# EAGLE design TEFNUT_proto_v1 (EAGLE 9.7.0)

## Sheet 1 of 4: CONNECTORS
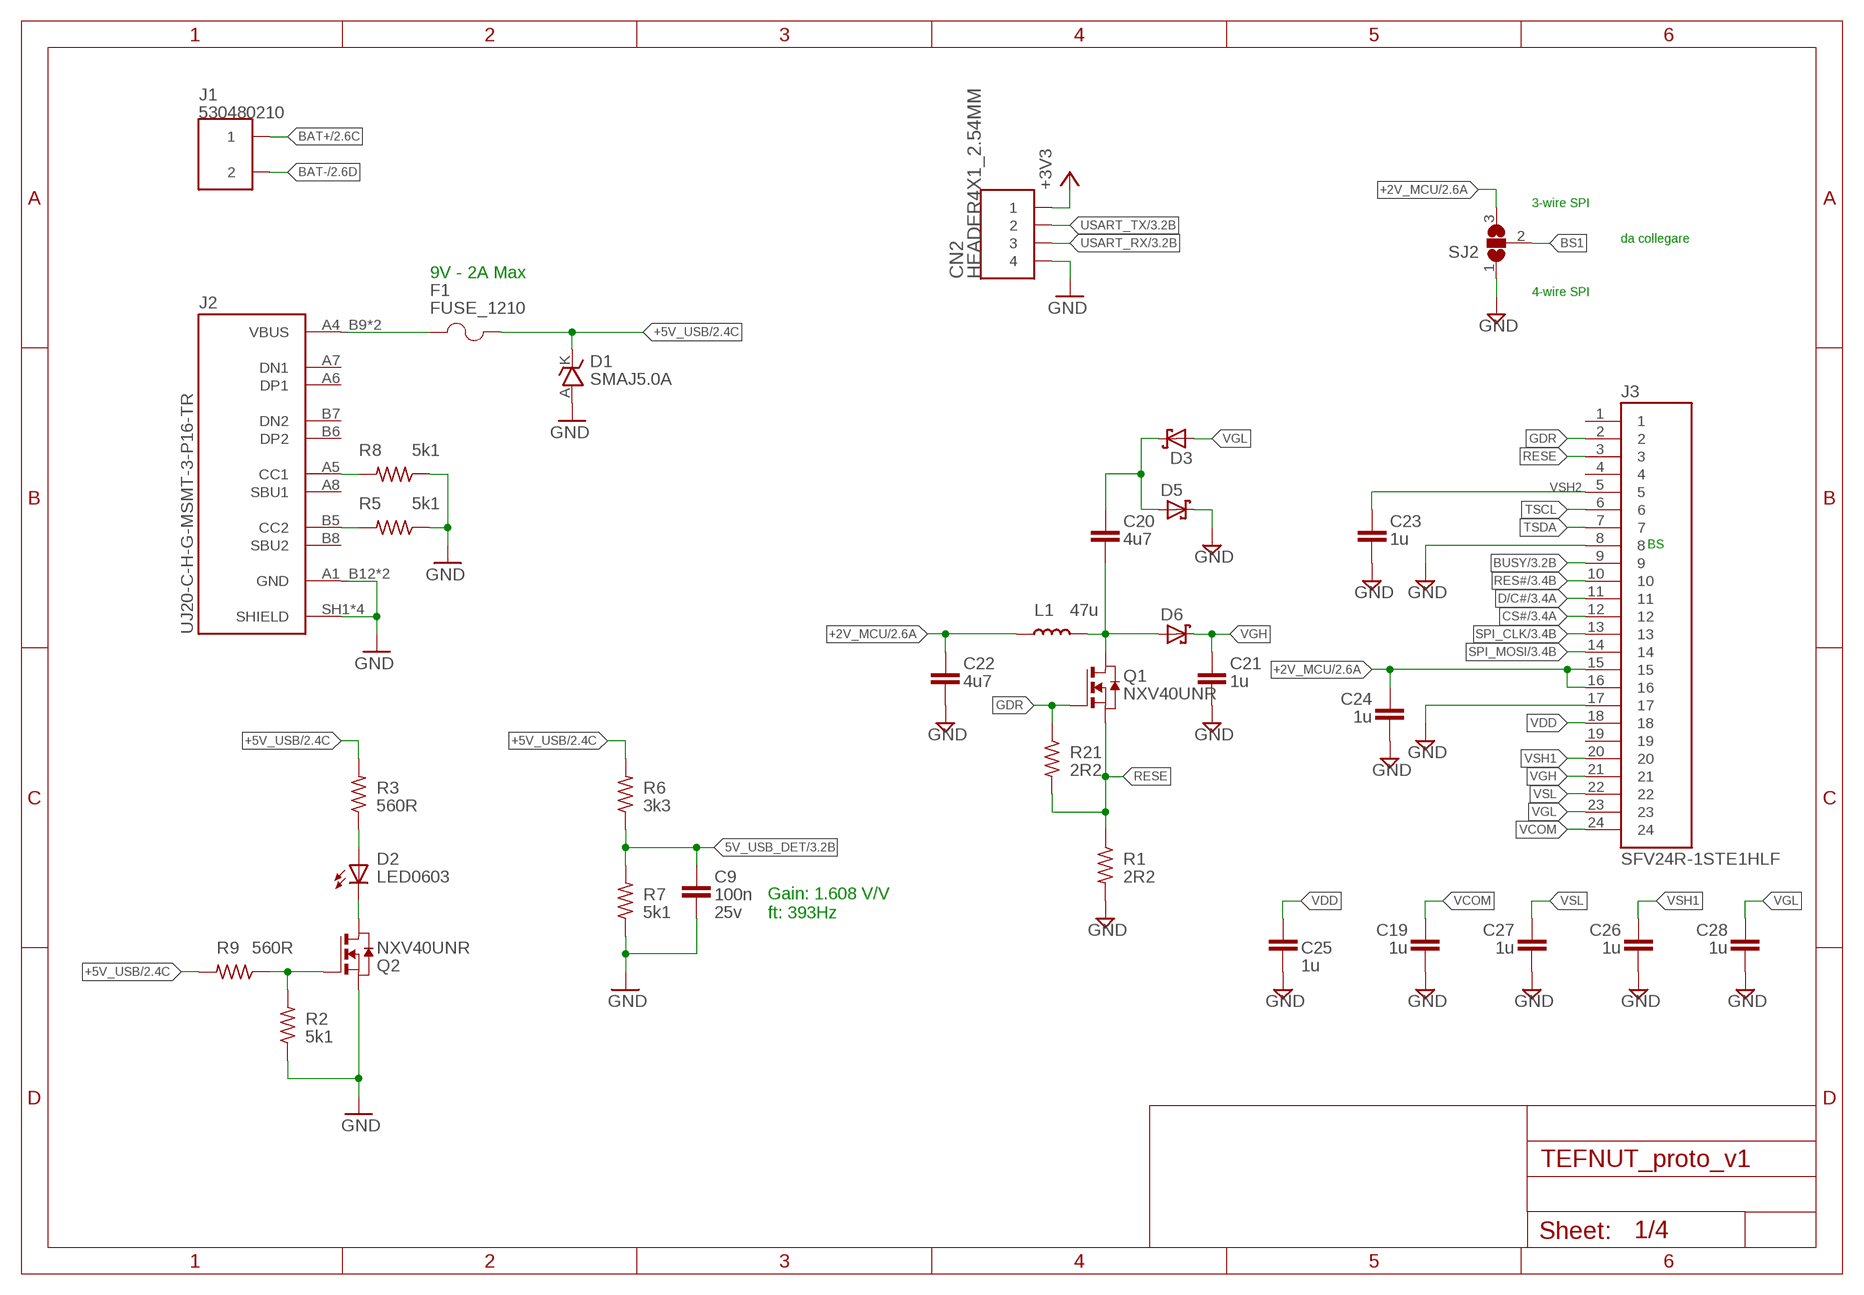
[diagram p0: schematic, sheet 1]

### Parts
C9  100n  C0603  [C0603[1608]]
C19  1u  C0603  [C0603[1608]]
C20  4u7  C0603  [C0603[1608]]
C21  1u  C0603  [C0603[1608]]
C22  4u7  C0603  [C0603[1608]]
C23  1u  C0603  [C0603[1608]]
C24  1u  C0603  [C0603[1608]]
C25  1u  C0603  [C0603[1608]]
C26  1u  C0603  [C0603[1608]]
C27  1u  C0603  [C0603[1608]]
C28  1u  C0603  [C0603[1608]]
CN2  HEADER4X1_2.54MM  [HEADER4X1_2.54MM]
D1  TVS214AC  [DO-214AC]
D2  LED0603  [LED0603]
D3  SCHOTTKY_DIODE_SOD123  [SOD123]
D5  SCHOTTKY_DIODE_SOD123  [SOD123]
D6  SCHOTTKY_DIODE_SOD123  [SOD123]
F1  FUSE_1210  [R1210[3225]]
J1  530480210  [530480210]
J2  UJ20-C-H-G-MSMT-3-P16-TR  [SAMESKY_UJ20-C-H-G-MSMT-3-P16-TR]
J3  SFV24R-1STE1HLF  [AMPHENOL_SFV24R-1STE1HLF]
L1  47u  L0805  [L0805[2012]]
Q1  NXV40UNR  MOSFET_N_SOT23-3  [SOT23-3]
Q2  NXV40UNR  MOSFET_N_SOT23-3  [SOT23-3]
R1  2R2  R_0603  [R0603]
R2  5k1  R_0603  [R0603]
R3  560R  R_0603  [R0603]
R5  5k1  R_0603  [R0603]
R6  3k3  R_0603  [R0603]
R7  5k1  R_0603  [R0603]
R8  5k1  R_0603  [R0603]
R9  560R  R_0603  [R0603]
R21  2R2  R_0603  [R0603]
SJ2  SJ2W  [SJ_2]

### Nets
5V_USB_DET: C9.1 R6.1 R7.2 ; also sheet 3
+2V_MCU: C22.1 C24.1 J3.15 J3.16 L1.1 SJ2.3 ; also sheet 2,3,4
+3V3 [Supply]: CN2.1
+5V_USB: D1.K F1.2 R3.2 R6.2 R9.2 ; also sheet 2
BAT+ [Supply]: J1.1 ; also sheet 2
BAT-: J1.2 ; also sheet 2
BS1: SJ2.2
BUSY: J3.9 ; also sheet 3
CS#: J3.12 ; also sheet 3
D/C#: J3.11 ; also sheet 3
GDR: J3.2 Q1.1(G) R21.1
GND [Supply]: C9.2 C19.2 C21.2 C22.2 C23.2 C24.2 C25.2 C26.2 C27.2 C28.2 CN2.4 D1.A D5.K J2.A1_B12(GND) J2.B1_A12(GND) J2.SH1(SHIELD) J2.SH2(SHIELD) J2.SH3(SHIELD) J2.SH4(SHIELD) J3.8 J3.17 Q2.2(S) R1.2 R2.1 R5.1 R7.1 R8.1 SJ2.1 ; also sheet 2,3,4
N$2: D2.2(K) Q2.3(D)
N$3: D2.1(A) R3.1
N$4: J2.A5(CC1) R8.2
N$5: J2.B5(CC2) R5.2
N$6: F1.1 J2.A4_B9(VBUS) J2.B4_A9(VBUS)
N$14: C20.1 D3.K D5.A
N$16: C20.2 D6.A L1.2 Q1.3(D)
N$81: Q2.1(G) R2.2 R9.1
RES#: J3.10 ; also sheet 3
RESE: J3.3 Q1.2(S) R1.1 R21.2
SPI_CLK: J3.13 ; also sheet 3
SPI_MOSI: J3.14 ; also sheet 3
TSCL: J3.6
TSDA: J3.7
USART_RX: CN2.3 ; also sheet 3
USART_TX: CN2.2 ; also sheet 3
VCOM: C19.1 J3.24
VDD: C25.1 J3.18
VGH: C21.1 D6.K J3.21
VGL: C28.1 D3.A J3.23
VSH1: C26.1 J3.20
VSH2: C23.1 J3.5
VSL: C27.1 J3.22
Unconnected: J2.A6(DP1) J2.A7(DN1) J2.A8(SBU1) J2.B6(DP2) J2.B7(DN2) J2.B8(SBU2) J3.1 J3.4 J3.19

### Notes on the sheet
- 3-wire SPI
- da collegare
- 9V - 2A Max
- 4-wire SPI
- BS
- Gain: 1.608 V/V
  ft: 393Hz

## Sheet 2 of 4: SUPPLY
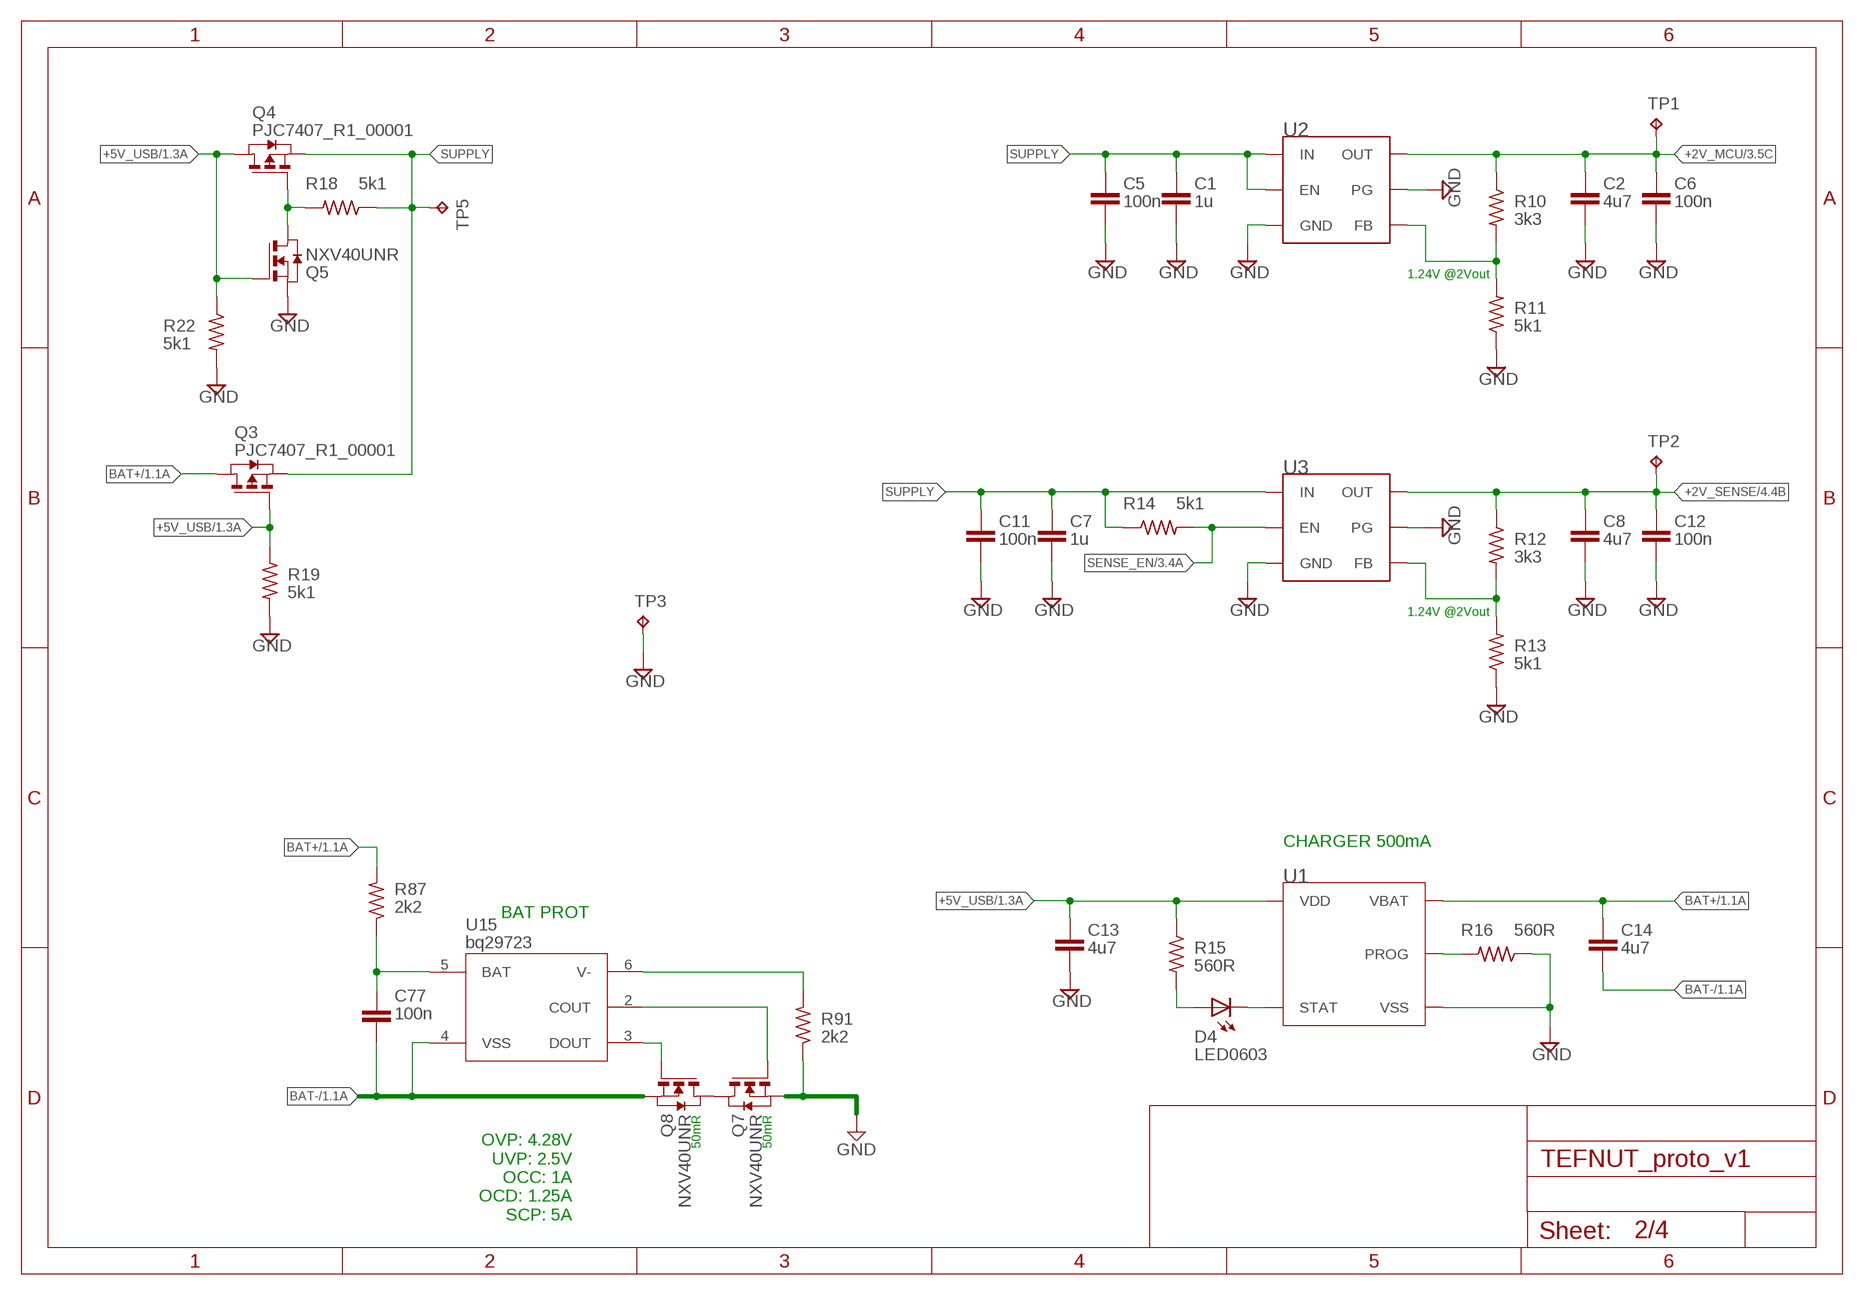
[diagram p1: schematic, sheet 2]

### Parts
C1  1u  C0603  [C0603[1608]]
C2  4u7  C0603  [C0603[1608]]
C5  100n  C0603  [C0603[1608]]
C6  100n  C0603  [C0603[1608]]
C7  1u  C0603  [C0603[1608]]
C8  4u7  C0603  [C0603[1608]]
C11  100n  C0603  [C0603[1608]]
C12  100n  C0603  [C0603[1608]]
C13  4u7  C0805  [C0805[2012]]
C14  4u7  C0805  [C0805[2012]]
C77  100n  C0603  [C0603[1608]]
D4  LED0603  [LED0603]
Q3  PJC7407_R1_00001  MOSFET_P_SOT323  [SOT323-3(SC-70-3)]
Q4  PJC7407_R1_00001  MOSFET_P_SOT323  [SOT323-3(SC-70-3)]
Q5  NXV40UNR  MOSFET_N_SOT23-3  [SOT23-3]
Q7  NXV40UNR  MOSFET_N_SOT23-3  [SOT23-3]
Q8  NXV40UNR  MOSFET_N_SOT23-3  [SOT23-3]
R10  3k3  R_0603  [R0603]
R11  5k1  R_0603  [R0603]
R12  3k3  R_0603  [R0603]
R13  5k1  R_0603  [R0603]
R14  5k1  R_0603  [R0603]
R15  560R  R_0603  [R0603]
R16  560R  R_0603  [R0603]
R18  5k1  R_0603  [R0603[1608]]
R19  5k1  R_0603  [R0603[1608]]
R22  5k1  R_0603  [R0603[1608]]
R87  2k2  R_0603  [R0603]
R91  2k2  R_0603  [R0603]
TP1  TPB1,27  [B1,27]
TP2  TPB1,27  [B1,27]
TP3  TPB1,27  [B1,27]
TP5  TPB1,27  [B1,27]
U1  MCP73831T  [SOT23-5]
U2  TPS7A2501DRVRDRV0006A-IPC_B  [6-WDFN]
U3  TPS7A2501DRVRDRV0006A-IPC_B  [6-WDFN]
U15  bq29723  BQ297XX  [WSON6]

### Nets
+2V_MCU: C2.1 C6.1 R10.1 TP1.TP U2.1(OUT) ; also sheet 1,3,4
+2V_SENSE: C8.1 C12.1 R12.1 TP2.TP U3.1(OUT) ; also sheet 4
+5V_USB: C13.1 Q3.1(G) Q4.3(D) Q5.1(G) R15.1 R19.1 R22.1 U1.4(VDD) ; also sheet 1
BAT+ [Supply]: C14.1 Q3.3(D) R87.2 U1.3(VBAT) ; also sheet 1
BAT-: C14.2 C77.2 Q8.2(S) U15.4(VSS) ; also sheet 1
GND [Supply]: C1.2 C2.2 C5.2 C6.2 C7.2 C8.2 C11.2 C12.2 C13.2 Q5.2(S) Q7.2(S) R11.1 R13.1 R16.1 R19.2 R22.2 R91.1 TP3.TP U1.2(VSS) U2.3(PG) U2.5(GND) U2.7(GND) U3.3(PG) U3.5(GND) U3.7(GND) ; also sheet 1,3,4
N$1: C77.1 R87.1 U15.5(BAT)
N$7: D4.1(A) R15.2
N$8: R10.2 R11.2 U2.2(FB)
N$9: R12.2 R13.2 U3.2(FB)
N$11: R16.2 U1.5(PROG)
N$12: D4.2(K) U1.1(STAT)
N$15: Q4.1(G) Q5.3(D) R18.2
N$18: R91.2 U15.6(V-)
N$19: Q7.3(D) Q8.3(D)
N$20: Q7.1(G) U15.2(COUT)
N$24: Q8.1(G) U15.3(DOUT)
SENSE_EN: R14.2 U3.4(EN) ; also sheet 3
SUPPLY: C1.1 C5.1 C7.1 C11.1 Q3.2(S) Q4.2(S) R14.1 R18.1 TP5.TP U2.4(EN) U2.6(IN) U3.6(IN)

### Notes on the sheet
- 1.24V @2Vout
- 1.24V @2Vout
- CHARGER 500mA
- BAT PROT
- 50mR | 50mR
- OVP: 4.28V
  UVP: 2.5V
  OCC: 1A
  OCD: 1.25A
  SCP: 5A

## Sheet 3 of 4: MCU
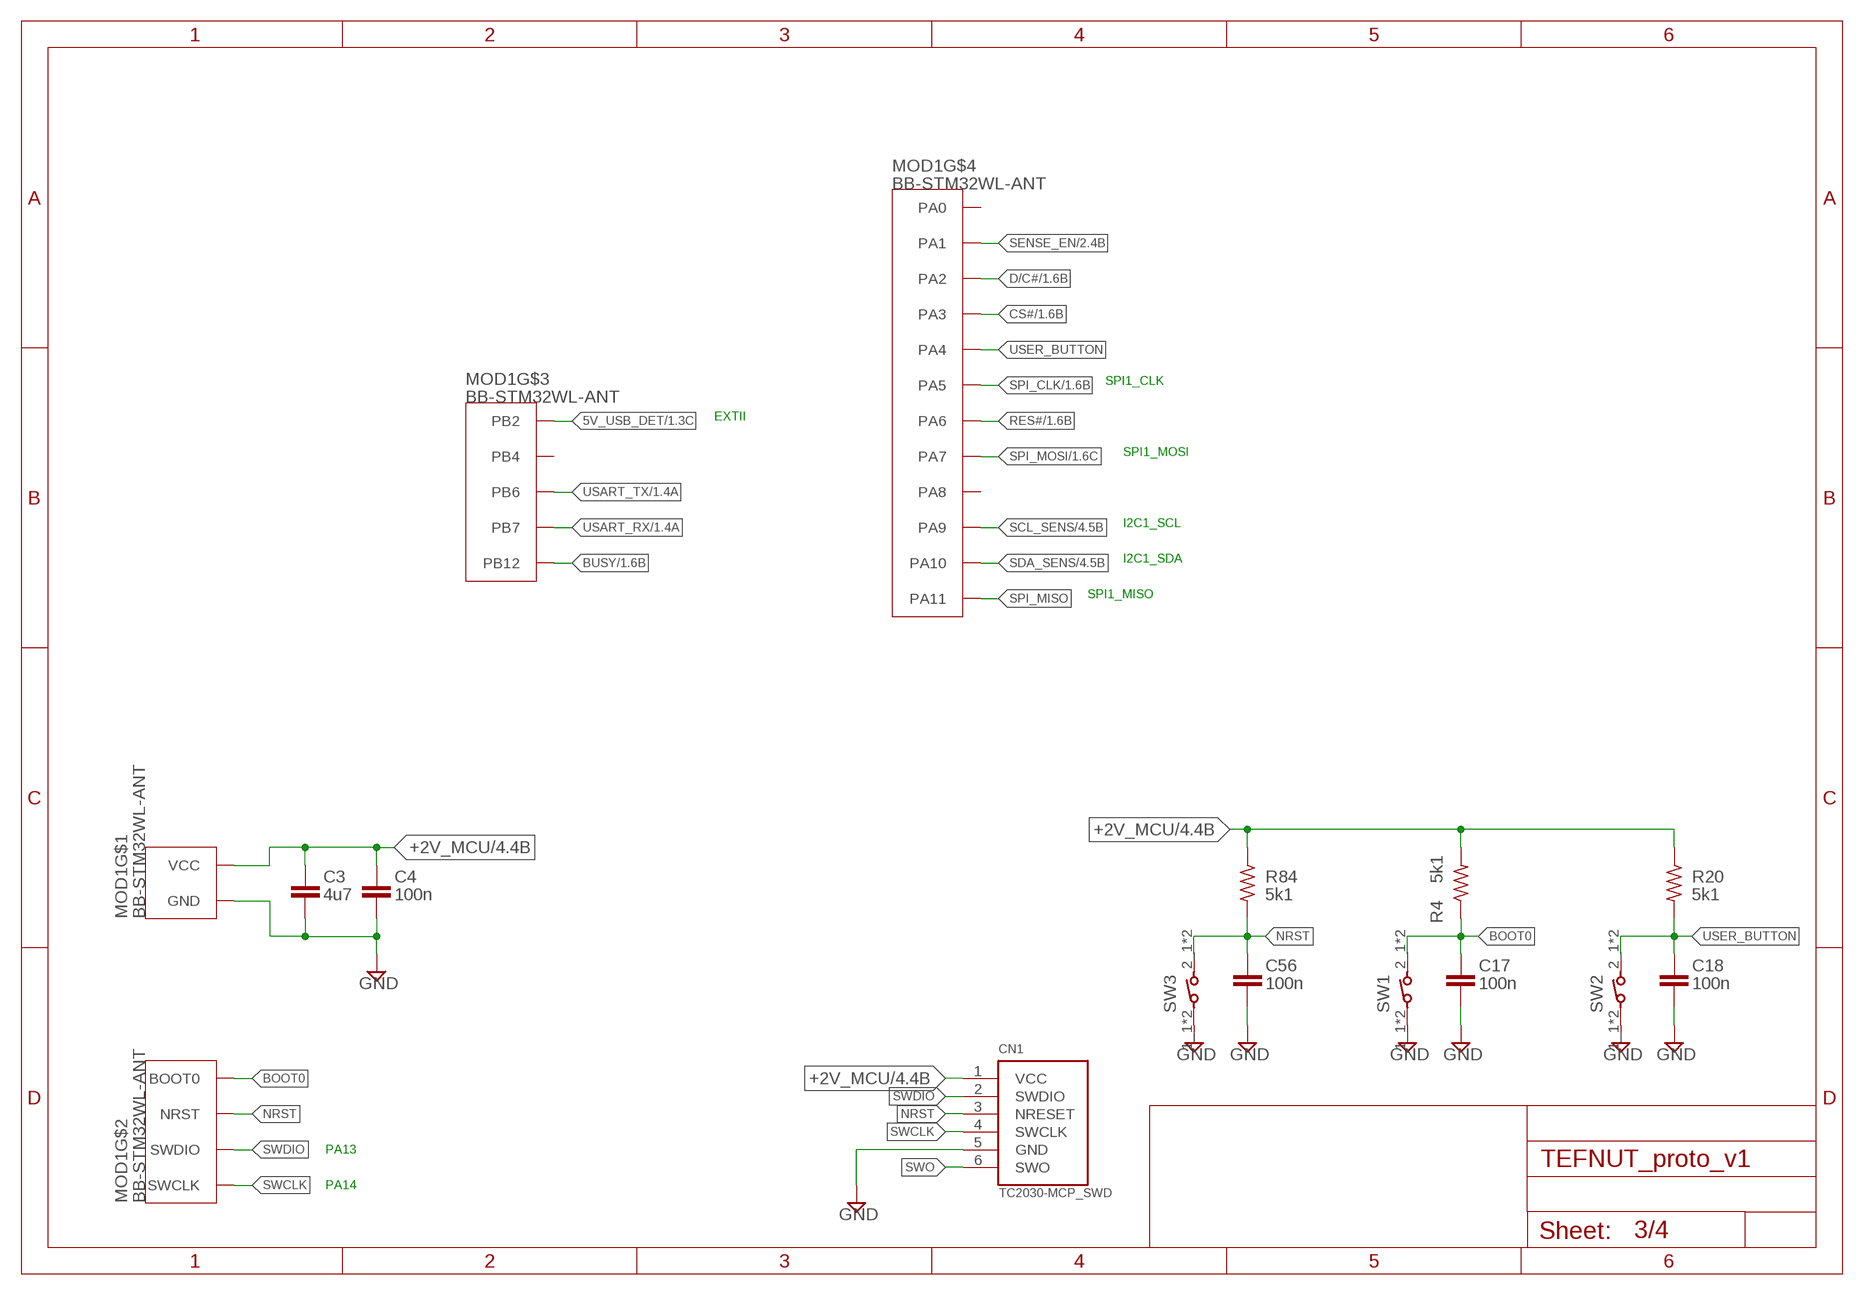
[diagram p2: schematic, sheet 3]

### Parts
C3  4u7  C0805  [C0805[2012]]
C4  100n  C0805  [C0805[2012]]
C17  100n  C0603  [C0603[1608]]
C18  100n  C0603  [C0603[1608]]
C56  100n  C0603  [C0603[1608]]
CN1  TC2030-MCP_SWD  [TC2030-IDC]
MOD1  BB-STM32WL-ANT  [BB-STM32WL-ANT]
R4  5k1  R_0603  [R0603]
R20  5k1  R_0603  [R0603]
R84  5k1  R_0603  [R0603]
SW1  SWITCHEVQ_4PIN  [EVQ-P7L01P]
SW2  SWITCHEVQ_4PIN  [EVQ-P7L01P]
SW3  SWITCHEVQ_4PIN  [EVQ-P7L01P]

### Nets
5V_USB_DET: MOD1.PB2 ; also sheet 1
+2V_MCU: C3.1 C4.1 CN1.1(VCC) MOD1.VCC R4.2 R20.1 R84.1 ; also sheet 1,2,4
BOOT0: C17.1 MOD1.BOOT0 R4.1 SW1.2_1 SW1.2_2
BUSY: MOD1.PB12 ; also sheet 1
CS#: MOD1.PA3 ; also sheet 1
D/C#: MOD1.PA2 ; also sheet 1
GND [Supply]: C3.2 C4.2 C17.2 C18.2 C56.2 CN1.5(GND) MOD1.GND MOD1.GND@2(GND) SW1.1_1 SW1.1_2 SW2.1_1 SW2.1_2 SW3.1_1 SW3.1_2 ; also sheet 1,2,4
NRST: C56.1 CN1.3(NRESET) MOD1.NRST R84.2 SW3.2_1 SW3.2_2
RES#: MOD1.PA6 ; also sheet 1
SCL_SENS: MOD1.PA9 ; also sheet 4
SDA_SENS: MOD1.PA10 ; also sheet 4
SENSE_EN: MOD1.PA1 ; also sheet 2
SPI_CLK: MOD1.PA5 ; also sheet 1
SPI_MISO: MOD1.PA11
SPI_MOSI: MOD1.PA7 ; also sheet 1
SWCLK: CN1.4(SWCLK) MOD1.SWCLK
SWDIO: CN1.2(SWDIO) MOD1.SWDIO
SWO: CN1.6(SWO)
USART_RX: MOD1.PB7 ; also sheet 1
USART_TX: MOD1.PB6 ; also sheet 1
USER_BUTTON: C18.1 MOD1.PA4 R20.2 SW2.2_1 SW2.2_2
Unconnected: MOD1.PA0 MOD1.PA8 MOD1.PB4

### Notes on the sheet
- SPI1_CLK
- EXTII
- SPI1_MOSI
- I2C1_SCL
- I2C1_SDA
- SPI1_MISO
- PA13
- PA14

## Sheet 4 of 4: SENSORS
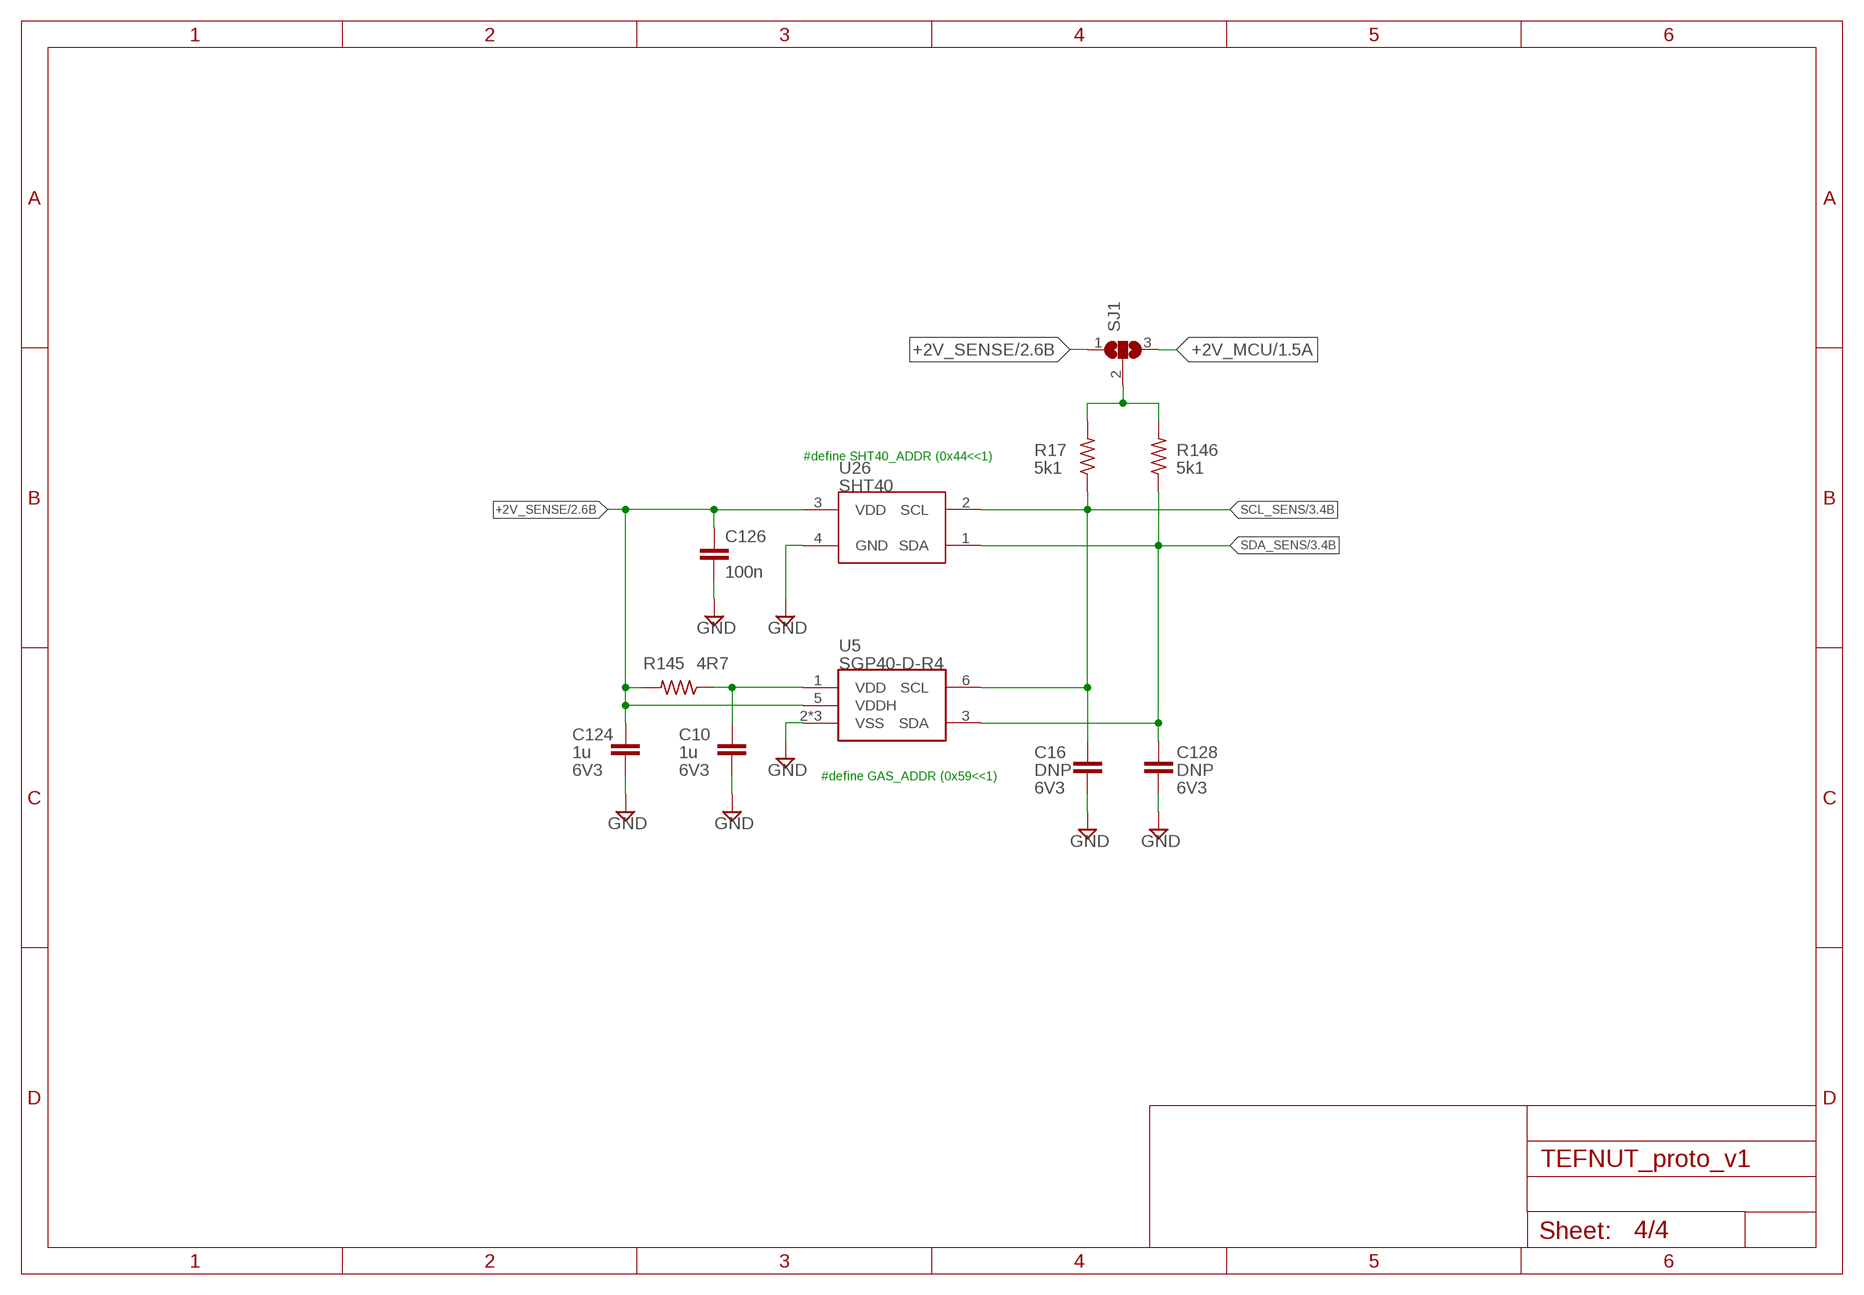
[diagram p3: schematic, sheet 4]

### Parts
C10  1u  C0603  [C0603[1608]]
C16  DNP  C0603  [C0603[1608]]
C124  1u  C0603  [C0603[1608]]
C126  100n  C0603  [C0603[1608]]
C128  DNP  C0603  [C0603[1608]]
R17  5k1  R_0603  [R0603[1608]]
R145  4R7  R_0603  [R0603]
R146  5k1  R_0603  [R0603[1608]]
SJ1  SJ2W  [SJ_2]
U5  SGP40-D-R4  SGP30  [DFN6]
U26  SHT40  [SH4X]

### Nets
+2V_MCU: SJ1.3 ; also sheet 1,2,3
+2V_SENSE: C124.2 C126.1 R145.2 SJ1.1 U5.5(VDDH) U26.3(VDD) ; also sheet 2
GND [Supply]: C10.1 C16.1 C124.1 C126.2 C128.1 U5.2(VSS) U5.4(VSS) U5.7(VSS) U26.4(GND) ; also sheet 1,2,3
N$10: R17.2 R146.2 SJ1.2
N$87 [Supply]: C10.2 R145.1 U5.1(VDD)
SCL_SENS: C16.2 R17.1 U5.6(SCL) U26.2(SCL) ; also sheet 3
SDA_SENS: C128.2 R146.1 U5.3(SDA) U26.1(SDA) ; also sheet 3

### Notes on the sheet
- #define SHT40_ADDR (0x44<<1)
- #define GAS_ADDR (0x59<<1)

## Library data of the parts
C1 C7 C19 C21 C23-C28 = MP-PASS:C; PARTNO: CL10A105KO8NNNC
C2 C8 C20 C22 = MP-PASS:C; PARTNO: CL10A475KO8NNNC
C3 C13 C14 = MP-PASS:C; PARTNO: CL21A475KOFNNNE
C4 = MP-PASS:C; PARTNO: CC0805KRX7R7BB104
C5 C6 C11 C12 C77 = MP-PASS:C; PARTNO: CL10B104KO8NNNC
C9 = MP-PASS:C; PARTNO: CL10B104KO8NNNC; VOLT: 25v
C10 C124 = MP-PASS:C; PARTNO: CL10A105KO8NNNC; VOLT: 6V3
C16 = AlmaPASS:C; DNP: T; PARTNO: *; V: 6V3
C17 C18 C56 C126 = AlmaPASS:C; PARTNO: CL10B104KO8NNNC
C128 = AlmaPASS:C; DNP: T; PARTNO: *; VOLT: 6V3
CN1 = AlmaCONN:TC2030-MCP_SWD; DNP: T
CN2 = MP-CONN:HEADER4X1
D1 = MP-DIS:TVS; PARTNO: SMAJ5.0A; PROD: littlefuse
D2 D4 = MP_DISCRETE:LED0603: LED 0603 (GENERIC)
D3 D5 D6 = AlmaDISC:SCHOTTKY_DIODE; PARTNO: MBR0530
F1 = MP-PASS:FUSE; PARTNO: SMD1210B110TF/16
J1 = MP-CONN:530480210; PARTNO: 530480210
J2 = MP-CONN:UJ20-C-H-G-MSMT-3-P16-TR; MANUFACTURER: Same Sky; MAXIMUM_PACKAGE_HEIGHT: 3.36mm; PARTNO: UJ20-C-H-G-MSMT-3-P16; PARTREV: 1.0; STANDARD: Manufacturer Recommendations
J3 = MP-CONN:SFV24R-1STE1HLF; MANUFACTURER: Amphenol; MAXIMUM_PACKAGE_HEIGHT: 2.36mm; PARTNO: SFV24R-1STE1HLF; PARTREV: C; STANDARD: Manufacturer Recommendations
L1 = MP-PASS:L; PARTNO: MLF2012E100JT000
MOD1 = MP_MOD:BB-STM32WL-ANT
Q1 Q2 Q5 Q7 Q8 = AlmaDISC:MOSFET_N; PARTNO: NXV40UNR
Q3 Q4 = AlmaDISC:MOSFET_P; PARTNO: PJC7407_R1_00001
R1 R21 = MP-PASS:R; PARTNO: ERJ-U03F2R20V
R2 R4 R5 R7 R8 R11 R13 R14 R20 R84 = MP-PASS:R; PARTNO: RC0603FR-075K1L
R3 R9 R15 R16 = MP-PASS:R; PARTNO: RC0603FR-07560RL
R6 R10 R12 = MP-PASS:R; PARTNO: RC0603FR-073K3L
R17-R19 R22 R146 = AlmaPASS:R; PARTNO: RC0603FR-075K1L
R87 R91 = MP-PASS:R; PARTNO: ERJ-3EKF2201V
R145 = MP-PASS:R; PARTNO: AC0603FR-072R2L
SJ1 SJ2 = EPS_NPC_r1.0:SJ2W: SMD solder JUMPER
SW1-SW3 = MP-MECH:SWITCH; PARTNO: EVQP7L01P
TP1-TP3 TP5 = testpad:TP: Test pad
U1 = MP-IC:MCP73831T; PARTNO: MCP73831T-2DCI/OT
U2 U3 = MP-IC:TPS7A2501DRVR; COPYRIGHT: Copyright (C) 2025 Ultra Librarian. All rights reserved.; MANUFACTURER_PART_NUMBER: TPS7A2501DRVR; MFR_NAME: Texas Instruments; PARTNO: TPS7A2501DRVR; REFDES: RefDes; TYPE: TYPE
U5 = AlmaSENS:SGP30; PARTNO: SGP40-D-R4
U15 = SPLabs-IC:BQ297XX; PARTNO: BQ29704DSER
U26 = AlmaIC:SHT40; PARTNO: SHT40-AD1B-R3

## Net classes
6 Supply: width 0.3 mm, drill 0.2 mm

## Board
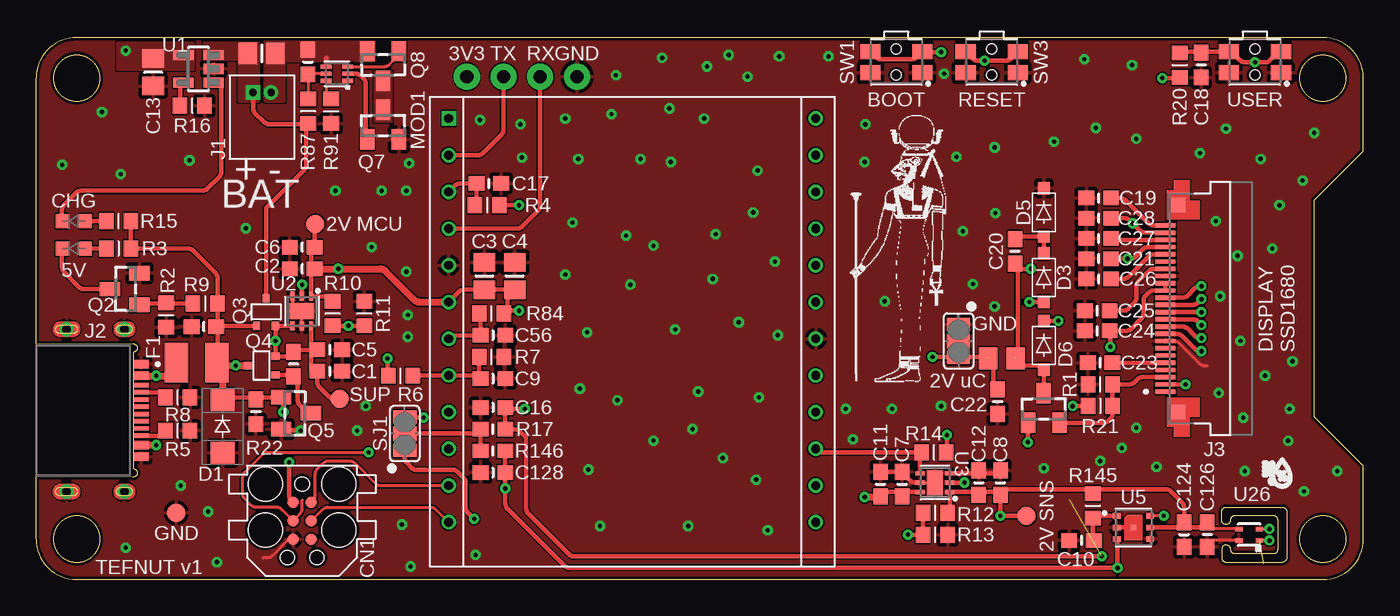
[diagram p4: board, top side]
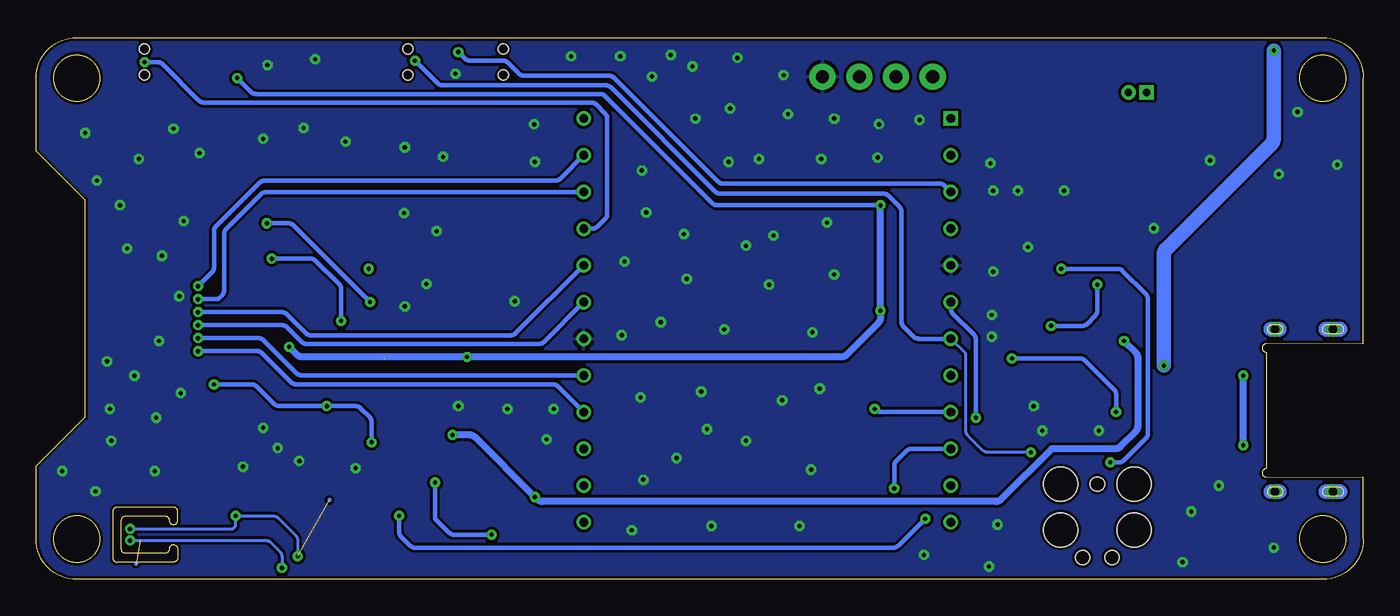
[diagram p5: board, bottom side, seen from below]

Size 91.8 x 37.5 mm. Coordinates in mm from the lower left corner, seen from the top.
Outline: 0,16.3 0,34.7 arc-90 2.8,37.5 89,37.5 arc-90 91.8,34.7 91.8,29.65 88.4,26.25 88.4,11.25 91.8,7.85 91.8,2.8 arc-90 89,0 2.8,0 arc-90 0,2.8 0,7.1
Outline: 82.6,2.1 arc90 82.9,1.8 85.6,1.8 arc90 85.9,2.1 85.9,4.1 arc90 85.6,4.4 82.9,4.4 arc90 82.6,4.1 arc-90 82.3,3.8 arc-90 82,4.1 82,4.7 arc-90 82.3,5 86.2,5 arc-90 86.5,4.7 86.5,1.5 arc-90 86.2,1.2 82.3,1.2 arc-90 82,1.5 82,2.1 arc-90 82.3,2.4 arc-90 82.6,2.1
Outline: circle at 89,34.7 radius 1.6
Outline: circle at 89,2.8 radius 1.6
Outline: circle at 2.8,34.7 radius 1.6
Outline: circle at 2.8,2.8 radius 1.6
Copper layers (1*16): Top 0.035mm / dielectric 1.5mm / Bottom 0.035mm
Design rules "Fusion Electronics Design Rules *": minimum track width 0.1mm, minimum drill 0.2mm, track to track 0.1mm, track to pad 0.1mm, pad to pad 0.15mm, via to via 0.1mm, smd to smd 0.2mm, copper to edge 0.2mm, drill to drill 0.2mm, minimum pad ring 0.2mm, minimum via ring 0.2mm, stop-mask expansion 0.1mm, vias tented up to drill 0mil, thermal gap 10mil

### Footprints (pad centres in the part's own frame; a part is rotated, then mirrored left to right if it is on the bottom)
C0603[1608] = smd 1.1 x 1: 1 -0.85,0; 2 0.85,0
C0805[2012] = smd 1.3 x 1.5: 1 -0.95,0; 2 0.95,0
TC2030-IDC = smd 0.787 x 0.787: 1 1.27,-0.635; 2 1.27,0.635; 3 2.54,-0.635; 4 2.54,0.635; 5 3.81,-0.635; 6 3.81,0.635 | hole 2.375: 0,2.54; 3.175,2.54; 0,-2.54; 3.175,-2.54 | hole 0.991: 0,0; 5.08,1.016; 5.08,-1.016
HEADER4X1_2.54MM = drill 0.9 pad 1.8: 1 -3.81,0; 2 -1.27,0; 3 1.27,0; 4 3.81,0
DO-214AC = smd 1.55 x 1.65: A -1.85,0; K 1.85,0
LED0603 = smd 0.87 x 0.98: 1 -0.815,0; 2 0.815,0
SOD123 = smd 0.85 x 0.85: A -1.675,0; K 1.675,0
R1210[3225] = smd 1.6 x 2.7: 1 -1.4,0; 2 1.4,0
530480210 = drill 0.5 pad 1 square: 1 -0.5,2 | drill 0.5 pad 1: 2 0.75,2
SAMESKY_UJ20-C-H-G-MSMT-3-P16-TR = smd 0.6 x 1.1: A1_B12 -3.2,7.25; A4_B9 -2.4,7.25; B1_A12 3.2,7.25; B4_A9 2.4,7.25 | smd 0.3 x 1.1: A5 -1.25,7.25; A6 -0.25,7.25; A7 0.25,7.25; A8 1.25,7.25; B5 1.75,7.25; B6 0.75,7.25; B7 -0.75,7.25; B8 -1.75,7.25 | drill 0.6 pad 1: SH1 -5.62,6.1; SH2 5.62,6.1; SH3 -5.62,2.1; SH4 5.62,2.1
AMPHENOL_SFV24R-1STE1HLF = smd 0.3 x 1.4: 1 -5.75,2.4; 2 -5.25,2.4; 3 -4.75,2.4; 4 -4.25,2.4; 5 -3.75,2.4; 6 -3.25,2.4; 7 -2.75,2.4; 8 -2.25,2.4; 9 -1.75,2.4; 10 -1.25,2.4; 11 -0.75,2.4; 12 -0.25,2.4; 13 0.25,2.4; 14 0.75,2.4; 15 1.25,2.4; 16 1.75,2.4; 17 2.25,2.4; 18 2.75,2.4; 19 3.25,2.4; 20 3.75,2.4; 21 4.25,2.4; 22 4.75,2.4; 23 5.25,2.4; 24 5.75,2.4 | smd 1 x 1: SH1 -7.175,1.5; SH2 7.175,1.5
L0805[2012] = smd 1.3 x 1.5: 1 -0.95,0; 2 0.95,0
BB-STM32WL-ANT = drill 0.6: BOOT0 0,-5.08; GND 0,-10.16; GND@2 25.4,-15.24; NRST 0,-15.24; PA0 25.4,-25.4; PA1 25.4,-22.86; PA2 25.4,-12.7; PA3 25.4,-10.16; PA4 25.4,-7.62; PA5 25.4,-5.08; PA6 25.4,-17.78; PA7 25.4,-2.54; PA9 0,-20.32; PA10 0,-22.86; PA11 25.4,0; PB2 0,-17.78; PB4 25.4,-27.94; PB6 0,-2.54; PB7 0,-7.62; PB12 25.4,-20.32; SWCLK 0,-27.94; SWDIO 0,-25.4; VCC 0,-12.7 | drill 0.6 square: PA8 0,0
SOT23-3 = smd 1.4 x 1: 1 0.95,-1.1; 2 0.95,1.1; 3 -1.1,0
SOT323-3(SC-70-3) = smd 0.5 x 0.58: 1 -0.65,-0.95; 2 0.65,-0.95; 3 0,0.95
R0603 = smd 1 x 1.1: 1 -0.85,0; 2 0.85,0
R0603[1608] = smd 1.1 x 1: 1 -0.85,0; 2 0.85,0
SJ_2 = smd 0.9 x 1.6: 1 -1.15,0; 3 1.15,0 | smd 1 x 1.6: 2 0,0
EVQ-P7L01P = smd 1.4 x 1.05: 1_1 -1.8,0.725; 1_2 1.8,0.725; 2_1 -1.8,-0.725; 2_2 1.8,-0.725 | hole 0.7: 0,0.9; 0,-0.9
B1,27 = smd 1.27 x 1.27: TP 0,0
SOT23-5 = smd 1.4 x 0.7: 1 1.05,-0.95; 2 1.05,0; 3 1.05,0.95; 4 -1.05,0.95; 5 -1.05,-0.95
6-WDFN = smd 0.656 x 0.292: 1 -1.028,0.65; 2 -1.028,0; 3 -1.028,-0.65; 4 1.028,-0.65; 5 1.028,0; 6 1.028,0.65 | smd 1.1 x 1.7: 7 0,0
DFN6 = smd 0.55 x 0.4: 1 -1.15,0.8; 2 -1.15,0; 3 -1.15,-0.8; 4 1.15,-0.8; 5 1.15,0; 6 1.15,0.8 | smd 0.35 x 0.4: 7 0,0
WSON6 = smd 0.28 x 0.75: 1 -0.5,-0.75; 2 0,-0.75; 3 0.5,-0.75; 4 0.5,0.75; 5 0,0.75; 6 -0.5,0.75
SH4X = smd 0.5 x 0.3: 1 -0.7,0.4; 2 -0.7,-0.4; 3 0.7,-0.4; 4 0.7,0.4

### Placement (x,y rotation side)
C1  20.3,14.4 0 top
C2  18.4,21.5 180 top
C3  31,21 90 top
C4  33.1,21 90 top
C5  20.3,15.9 0 top
C6  18.4,23 180 top
C7  59.9,6.6 90 top
C8  66.7,6.7 90 top
C9  31.6,13.9 0 top
C10  72.3,2.7 0 top
C11  58.4,6.6 90 top
C12  65.2,6.7 90 top
C13  8.1,35.1 270 top
C14  15.6,36.4 0 top
C16  31.6,11.9 0 top
C17  31.3,27.4 0 top
C18  80.59,35.59 270 top
C19  73.5,26.4 180 top
C20  67.7,22.7 270 top
C21  73.5,22.2 180 top
C22  66.5,12.3 270 top
C23  73.6,15 180 top
C24  73.4,17.2 180 top
C25  73.4,18.6 180 top
C26  73.5,20.8 180 top
C27  73.5,23.6 180 top
C28  73.5,25 180 top
C56  31.6,16.9 0 top
C77  18.8,35.8 90 top
C124  79.4,3.1 90 top
C126  81,3.1 270 top
C128  31.6,7.4 0 top
CN1  18.4,6.6 270 top
CN2  33.6,34.8 0 top
D1  12.9,10.6 90 top
D2  2.6,22.9 180 top
D3  69.7,20.9 90 top
D4  2.6,24.8 180 top
D5  69.7,25.4 90 top
D6  69.7,16.2 90 top
F1  11.1,15 0 top
J1  15.5,31.7 0 top
J2  0,11.7 270 top
J3  80.5,18.75 90 top
L1  66.8,15.3 0 top
MOD1  28.53,31.9 0 top
Q1  69.7,11.8 270 top
Q2  6.2,20.1 0 top
Q3  15.9,18.5 0 top
Q4  15.6,14.8 90 top
Q5  17.9,11.5 180 top
Q7  24,31.4 270 top
Q8  24,35.6 90 top
R1  73.6,13.5 180 top
R2  9,18.3 90 top
R3  5.7,22.9 0 top
R4  31.2,25.9 0 top
R5  9.8,10.3 180 top
R6  25.2,14.1 180 top
R7  31.5,15.4 180 top
R8  9.8,12.6 180 top
R9  11.7,19.1 0 top
R10  20.5,18.4 270 top
R11  22.7,18.4 270 top
R12  62.2,4.6 180 top
R13  62.2,3.1 180 top
R14  62.1,8.8 180 top
R15  5.7,24.8 180 top
R16  10.8,32.8 180 top
R17  31.6,10.4 180 top
R18  17.8,14.9 270 top
R19  11.6,17.5 180 top
R20  79.1,35.6 90 top
R21  73.6,12 0 top
R22  15.2,11.6 270 top
R84  31.5,18.4 180 top
R87  18.8,32.4 270 top
R91  20.4,32.4 90 top
R145  73.1,5.1 90 top
R146  31.6,8.9 180 top
SJ1  25.5,10.1 90 top
SJ2  63.8,16.5 270 top
SW1  59.5,35.8 180 top
SW2  84.3,35.8 180 top
SW3  66.1,35.8 180 top
TP1  19.3,24.6 0 top
TP2  68.5,4.4 0 top
TP3  9.7,4.6 0 top
TP5  21,12.5 0 top
U1  11.23,35.33 0 top
U2  18.38,18.57 270 top
U3  62.17,6.7 180 top
U5  75.9,3.6 0 top
U15  20.8,35 90 top
U26  83.9,3.1 180 top

### Tracks (layer width: path | path; a pad name or v marks a point on that pad's centre or on a via)
5V_USB_DET
  Top 0.3: 30.68,13.97 arc45 30.32,14.12 MOD1.PB2 26.07,14.12 arc45 R6.1 | 30.68,13.97 C9.1 | R7.2 30.65,14.04 arc45 30.68,13.97
+2V_MCU  (via drill 0.3)  (2 unrouted)
  Top 0.3: MOD1.VCC 29.23,19.9 arc-45 29.59,20.05 C3.1 C4.1 32.6,20.05 32.6,18.6 | 32.6,18.6 32.6,18.4 R84.1 | J3.16 J3.15 77.31,20 arc45 76.95,19.85 76.75,19.65 arc45 76.6,19.29 76.6,18.41 arc-45 76.45,18.05 75.75,17.35 arc-45 75.39,17.2 74.4,17.2 | 74.4,17.2 C24.1 | R10.1 20.5,19.6 U2.1 19.03,21.4 | 19.03,21.4 19.03,23 C6.1 19.25,24.48 arc-45 TP1.TP | C2.1 19.25,21.4 19.03,21.4 | R4.2 v33.4,25.9 | v33.4,18.6 32.6,18.6 | v74.3,16.1 74.3,16.96 arc-45 74.4,17.2 | R20.1 arc-45 78.98,34.7 v77.9,34.7 | CN1.1 17.65,5.45 arc-45 17.5,5.8 v17.5,8.1 | SJ1.3 25.5,11.2 v26.8,11.2 | v62,15.4 63.9,15.4 | 63.9,15.4 65.77,15.4 | 65.77,15.4 arc-45 65.89,15.35 | SJ2.3 arc45 63.88,15.38 63.9,15.4 | C22.1 66.35,13.3 arc-45 66.2,13.66 66.2,14.8 arc45 66.08,15.09 65.77,15.4
  Top 0.5: C2.1 v20.9,21.5 23.79,21.5 arc-45 24.15,21.35 26.15,19.35 arc45 26.51,19.2 MOD1.VCC | 65.89,15.35 L1.1
  Bottom 0.3: v17.5,8.1 16.91,8.1 arc-45 16.55,8.25 15.05,9.75 arc-45 14.9,10.11 14.9,19.39 arc-45 15.05,19.75 16.65,21.35 arc-45 17.01,21.5 v20.9,21.5 | MOD1.VCC 28.53,18.74 arc-45 28.38,18.38 26.95,16.95 arc45 26.8,16.59 v26.8,11.2 | v77.9,34.7 76.95,33.75 arc-45 76.59,33.6 52.81,33.6 arc45 52.45,33.45 45.05,26.05 arc-45 44.69,25.9 v33.4,25.9
  Bottom 0.5: v74.3,16.1 73.75,15.55 arc-45 73.39,15.4 v62,15.4 36.11,15.4 arc-45 35.75,15.55 33.55,17.75 arc-45 33.4,18.11 v33.4,18.6 v33.4,25.9
+2V_SENSE  (via drill 0.3)
  Top 0.2: U26.3 81.1,3.5 | 79.4,3.5 C124.2 79.5,3.95 79.5,3.6 | 81.1,3.5 81.1,3.8 81.1,3.95 C126.1 81,3.5 81.1,3.5
  Top 0.3: 65.3,6.05 66.7,6.05 | R12.1 R12.1 arc45 63.2,4.96 U3.1 65.3,6.05 | C12.1 65.23,5.88 arc45 65.3,6.05 | 66.7,6.05 C8.1 v66.7,4.4 TP2.TP | 66.7,6.05 66.7,6.25 73,6.25 | R145.2 73.1,6.15 73,6.25 | SJ1.1 25.5,8.41 arc45 25.65,8.05 26,7.7 arc45 26.24,7.6 28.79,7.6 arc-45 29.15,7.45 29.55,7.05 arc-45 29.7,6.69 29.7,5.01 arc45 29.85,4.65 v30.3,4.2 | U5.5 79.5,3.6 81.1,3.6 81.1,3.8 | 73,6.25 78.14,6.25 arc-45 78.5,6.1 79.25,5.35 arc-45 79.4,4.99 C124.2
  Bottom 0.3: v30.3,4.2 32.15,2.35 arc45 32.51,2.2 65.59,2.2 arc45 65.95,2.35 66.55,2.95 arc45 66.7,3.31 v66.7,4.4
+5V_USB  (via drill 0.3)
  Top 0.3: R15.1 R3.2 10.49,22.9 arc-45 10.85,22.75 12.4,21.2 arc-45 12.55,20.84 R9.2 12.55,17.74 | 12.55,17.74 arc-45 R19.1 12.45,17.55 Q3.1 | F1.2 arc45 12.55,15.12 12.55,17.74 | D1.K D1.K arc-45 13.26,12.6 15.3,12.6 | 15.3,12.6 Q5.1 Q5.1 arc-45 17.1,12.24 v17.1,11.6 | R22.1 arc-45 15.23,12.54 15.3,12.6 | v24.3,15.3 24.3,14.22 arc45 R6.2
  Top 0.5: D1.K 12.9,14.39 arc45 12.75,14.75 F1.2 12.55,14.95 arc45 12.91,14.8 v13.8,14.8 Q4.3
  Bottom 0.3: v17.1,11.6 17.1,12.79 arc-45 17.25,13.15 19.25,15.15 arc-45 19.61,15.3 v24.3,15.3
  Bottom 1: v13.8,14.8 13.8,22.49 arc45 13.65,22.85 6.35,30.15 arc-45 6.2,30.51 v6.2,36.6
  pour Top (isolate 0.2, no thermals): 5.6,35.3 10.9,35.3 10.9,37.1 5.6,37.1
BAT+
  Top 0.3: J1.1 15,32.68 arc45 15.2,32.2 15.69,31.71 arc45 16.2,31.5 18.68,31.5 | 18.68,31.5 arc45 R87.2 | Q3.3 15.9,25.7 18.53,28.33 arc45 18.68,28.69 18.68,31.5
  pour Top (isolate 0.2, no thermals): 11.6,37.1 11.6,36 13.92,36 13.96,35.98 13.98,35.96 14,35.92 14,33.1 15.4,33.1 15.4,37.1
BAT-
  Top 0.3: U15.4 20.05,35.98 arc-45 20.1,36.1
  pour Top (isolate 0.2, no thermals): 15.8,33.1 17.2,33.1 17.2,35.82 17.22,35.86 17.24,35.88 17.28,35.9 23.4,35.9 23.4,37.2 15.8,37.2
BOOT0  (via drill 0.3)
  Top 0.3: MOD1.BOOT0 28.96,27.25 arc-45 29.32,27.4 C17.1 30.45,26.14 arc-45 R4.1 | 57.83,36.47 arc45 SW1.2_2 58.08,36.15 arc45 58.43,36 60.57,36 arc45 60.92,36.15 SW1.2_1 arc45 61.36,36.5 v62.6,36.5
  Bottom 0.3: MOD1.BOOT0 28.96,27.25 arc-45 29.32,27.4 44.29,27.4 arc45 44.65,27.55 51.8,34.7 arc-45 52.16,34.85 58.04,34.85 arc45 58.4,35 59.15,35.75 arc-45 59.51,35.9 | v62.6,36.5 62.15,36.05 arc-45 61.79,35.9 60.2,35.9 59.51,35.9 | 59.51,35.9 59.5,35.9
BUSY  (via drill 0.3)
  Top 0.3: J3.9 78.89,17 arc-45 79.25,16.85 80.15,15.95 arc45 80.51,15.8 v80.6,15.8
  Bottom 0.3: MOD1.PB12 55.7,13.35 arc-45 56.06,13.5 73.79,13.5 arc45 74.15,13.65 76.15,15.65 arc-45 76.51,15.8 v80.6,15.8
CS#  (via drill 0.3)
  Top 0.3: J3.12 v80.6,18.5
  Bottom 0.3: MOD1.PA3 58.62,17.05 arc45 58.98,16.9 72.79,16.9 arc45 73.15,17.05 74.45,18.35 arc-45 74.81,18.5 v80.6,18.5
D/C#  (via drill 0.3)
  Top 0.3: J3.11 79.99,18 arc-45 80.35,17.85 v80.6,17.6
  Bottom 0.3: MOD1.PA2 56.68,16.45 arc45 57.04,16.3 73.09,16.3 arc45 73.45,16.45 74.45,17.45 arc-45 74.81,17.6 v80.6,17.6
GDR  (via drill 0.3)
  Top 0.3: J3.2 v79.5,13.5 | v68.6,9.5 Q1.1 | R21.1 v71.7,12
  Bottom 0.3: v79.5,13.5 76.91,13.5 arc45 76.55,13.35 75.35,12.15 arc-45 74.99,12 v71.7,12 69.71,12 arc45 69.35,11.85 68.75,11.25 arc45 68.6,10.89 v68.6,9.5
GND  (via drill 0.3)
  Top 0.2: U26.4 81,2.7 C126.2 | J3.8 78.69,16.5 arc-45 79.05,16.35 80.45,14.95 arc45 80.81,14.8 81,14.8 | U3.5 U3.7 | U2.5 U2.7 17.97,18.57 arc-45 17.9,18.6 17.88,18.62 arc-45 17.73,18.98 U2.3 | CN1.5 17.7,2.79 arc45 17.34,2.64 16.35,1.65 arc-45 15.99,1.5 15.7,1.5
  Top 0.3: U5.2 U5.7 | U3.5 60.81,6.7 arc-45 60.45,6.85 59.94,7.37 arc-45 C7.2 C11.2 | U3.3 64.79,7.35 | 64.79,7.35 arc45 65.15,7.5 C12.2 | 64.79,7.35 66.7,7.35 C8.2 | Q5.2 16.95,10.3 v18.3,10.3
  other vias: 4.55,32.35 1.8,28.7 5.85,28.05 10.6,29 14.5,24.3 11.9,4.7 10,6.5 6.2,2.2 12.5,1.2 25.9,0.9 25.3,3.8 22.2,10.3 22.8,12 25.7,16.8 25.7,18.3 25.6,21.3 23.2,23 20.7,26.9 25.6,26.9 25.8,28.8 23.9,26.9 40.1,34.9 46.4,35.5 47.9,36.3 54.8,36.2 43.3,36.1 49.2,34.8 51.4,36.2 57.35,31.5 66.3,29.9 70.4,30.3 76.1,30.5 84.7,29.1 88.4,30.9 87.6,27.6 82.3,31.2 80.5,29.5 75.8,35.6 72.5,36 63.65,29.25 64.1,24.1 66.35,25.35 57.3,28.9 64.8,20.45 73.3,31.25 66.3,18.9 58.7,19.25 56.5,9.7 56,11.8 59.2,11.8 62.6,12 69.7,7.7 73.6,8.2 75.1,9.1 76.1,10.5 77.5,7.8 83.6,7.5 86.6,9.6 90,7.5 87.7,6.1 86.7,11.8 85,14.1 86.9,15.1 85.5,22.9 86,25.9 81.6,24.8 83.1,22.4 81.9,19.6 83.3,16.5 81.8,12.9 83.5,11.2 50.6,3.4 45.1,3.7 39,3.7 30.4,1.7 38.2,7.6 47.5,8.4 49.8,6.9 45.8,13 42.7,9.6 40.2,12.4 50,12.6 45.4,10.4 37.6,13.2 38.1,17.1 36.6,21.1 37.1,24.7 49.6,25.4 49.9,28.3 47,23.9 42.7,23.1 40.8,23.8 41.1,20.4 44.2,17.3 48.6,17.8 51.3,16.9 51.1,22 46.8,20.8 43.9,28.9 46.2,31.9 43.8,32.6 39.8,32.2 41.8,29.1 37.5,29.1 36.6,31.9 33.5,31.5 33.6,29.2 30.7,31.8 62.8,35
  pour Top (rank 6): 0,0 91.8,0 91.8,37.5 0,37.5
  pour Bottom (isolate 0.2, rank 6): -0.1,-0.1 91.9,-0.1 91.9,37.6 -0.1,37.6
N$1
  Top 0.2: U15.5 18.8,35 C77.1 R87.1
N$2
  Top 0.3: D2.2 1.78,21.62 arc45 1.93,21.27 2.95,20.25 arc45 3.31,20.1 Q2.3
N$3
  Top 0.3: R3.1 D2.1
N$4
  Top 0.3: J2.A5 8.95,12.95 R8.2
N$5
  Top 0.3: J2.B5 8.95,9.95 R5.2
N$6  (via drill 0.3)
  Top 0.5: J2.A4_B9 v8.3,14.1 9.7,14.1 F1.1 | J2.B4_A9 v8.3,9.3
  Bottom 0.5: v8.3,9.3 v8.3,14.1
N$7
  Top 0.3: R15.2 D4.1
N$8  (via drill 0.3)
  Top 0.3: R11.2 v21.6,17.55 R10.2 | v18.4,20.4 arc45 18.38,20.35 U2.2
  Bottom 0.3: v21.6,17.55 19.46,17.55 arc-45 19.1,17.7 18.55,18.25 arc-45 18.4,18.61 v18.4,20.4
N$9  (via drill 0.3)
  Top 0.3: R12.2 R13.2 v60.3,3.1 | U3.2 v64.2,6.7
  Bottom 0.3: v60.3,3.1 62.89,3.1 arc45 63.25,3.25 64.2,4.2 v64.2,6.7
N$10
  Top 0.3: R146.2 R17.2 30.53,10.18 arc-45 30.34,10.1 SJ1.2
N$11
  Top 0.3: U1.5 9.95,34.15 R16.2
N$12
  Top 0.3: 1.8,24.84 arc-45 D4.2 1.78,25.58 arc-45 1.93,25.93 2.75,26.75 arc-45 3.11,26.9 11.49,26.9 arc45 11.85,27.05 12.65,27.85 arc45 12.8,28.21 12.8,34.38 U1.1 12.41,34.38 arc-45 12.77,34.23
N$14
  Top 0.3: D3.K D5.A 68.08,23.73 arc45 67.73,23.58 C20.1
N$15
  Top 0.3: Q4.1 17.7,14.15 R18.2 17.95,13.9 arc-45 18.1,13.54 18.1,12.41 arc45 18.25,12.05 18.66,11.64 arc45 Q5.3
N$16  (via drill 0.3)  (1 unrouted)
  Top 0.3: Q1.3 D6.A 69.7,14.8 67.75,14.8 L1.2 L1.2 arc45 67.9,15.66 | 67.69,15.3 67.69,14.78 | v68.8,21.5 67.9,21.5 | 67.9,21.5 67.7,21.5 C20.2 | 67.9,15.63 67.9,15.66 | 67.9,15.66 67.9,21.5
N$18
  Top 0.2: U15.6 20.05,33.25 R91.2
N$19
  pour Top (isolate 0.2, no thermals): 23.4,31.7 24.6,31.7 24.6,35.1 23.4,35.1
N$20
  Top 0.3: U15.2 22.09,35 arc-45 22.45,34.85 22.65,34.65 arc-45 22.8,34.29 22.8,30.69 arc45 Q7.1
N$24
  Top 0.2: U15.3 24.09,35.5 arc45 24.45,35.65 24.95,36.15 arc45 25.1,36.51 Q8.1
N$81
  Top 0.3: R9.1 9.2,19.1 9.12,19.1 | 9.12,19.1 7.39,19.1 arc45 Q2.1 | R2.2 arc45 9.12,19.1
N$87
  Top 0.3: U5.1 73.1,4.4 R145.1 73.1,2.82 arc45 C10.2
NRST  (via drill 0.3)
  Top 0.2: 18.4,5.5 18.4,4.9 arc-45 18.25,4.55 CN1.3 16.97,4.85 arc45 16.62,5 15.21,5 arc-45 14.85,5.15 14.45,5.55 arc-45 14.3,5.91 14.3,7.09 arc-45 14.45,7.45 15.65,8.65 arc-45 16.01,8.8 v23,8.8
  Top 0.3: MOD1.NRST 28.62,16.75 arc-45 28.98,16.9 C56.1 30.75,18.16 arc45 R84.2 30.65,18 | CN1.3 arc-45 17.55,4.15 | SW3.2_2 64.78,36.05 arc45 65.13,35.9 v65.6,35.9 67.07,35.9 arc45 67.42,36.05 SW3.2_1
  Bottom 0.2: v23,8.8 25.99,8.8 arc45 26.35,8.95 27.35,9.95 arc45 27.5,10.31 27.5,15.63 MOD1.NRST
  Bottom 0.3: MOD1.NRST 30.75,16.66 arc45 31.11,16.81 31.8,17.5 arc45 31.95,17.86 31.95,25.44 arc-45 32.1,25.8 32.85,26.55 arc-45 33.21,26.7 44.49,26.7 arc45 44.85,26.85 52.05,34.05 arc-45 52.41,34.2 63.69,34.2 arc45 64.05,34.35 v65.6,35.9
RES#  (via drill 0.3)
  Top 0.3: J3.10 79.29,17.5 arc-45 79.65,17.35 80.15,16.85 arc45 80.51,16.7 v80.6,16.7
  Bottom 0.3: MOD1.PA6 73.41,14.12 arc45 73.77,14.27 76.05,16.55 arc-45 76.41,16.7 v80.6,16.7
RESE
  Top 0.3: J3.3 76.51,14 arc45 76.15,13.85 75.95,13.65 arc-45 75.59,13.5 R1.1 R21.2 74.45,11.46 arc-45 74.3,11.1 74.2,11 arc-45 73.84,10.85 Q1.2
SCL_SENS  (via drill 0.3)  (1 unrouted)
  Top 0.2: U26.2 v85.3,3.5 | v78,4.4 U5.6 | C16.2 32.7,11.9 32.7,11.8
  Top 0.3: 32.88,11.58 arc-45 32.69,11.66 C16.2 R17.1 33.09,10.4 arc-45 33.45,10.25 33.8,9.9 arc-45 33.9,9.66 33.9,4.91 arc45 34.05,4.55 36.85,1.75 arc45 37.21,1.6 v73.7,1.6 | v33.8,11.8 32.7,11.8 arc45 32.52,11.73
  Bottom 0.2: v85.3,3.5 78.3,3.5 arc-90 78,3.8 v78,4.4 75.41,4.4 arc45 75.05,4.25 73.85,3.05 arc45 73.7,2.69 v73.7,1.6
  Bottom 0.3: MOD1.PA9 33.37,11.58 arc45 33.73,11.73 v33.8,11.8 | 71.51,5.5 arc45 71.51,5.5
SDA_SENS  (via drill 0.3)  (1 unrouted)
  Top 0.2: v85.3,2.7 U26.1
  Top 0.3: R146.1 C128.2 v32.45,6.3 32.45,5.26 arc45 32.6,4.9 36.55,0.95 arc45 36.91,0.8 v74.8,0.8 74.8,2.8 U5.3
  Bottom 0.2: v85.3,2.7 75.91,2.7 arc45 75.55,2.55 74.95,1.95 arc45 74.8,1.59 v74.8,0.8
  Bottom 0.3: MOD1.PA10 31.25,9.04 arc-45 31.61,8.89 32.3,8.2 arc-45 32.45,7.84 v32.45,6.3 | 84.89,1.1 arc-45 84.89,1.1
SENSE_EN
  Top 0.3: U3.4 61.14,8.54 arc-45 R14.2 54.38,8.8 arc-45 54.02,8.95 MOD1.PA1
SPI_CLK  (via drill 0.3)
  Top 0.3: J3.13 79.99,19 arc45 80.35,19.15 v80.6,19.4
  Bottom 0.3: MOD1.PA5 75.87,26.82 arc-45 76.23,26.67 78.65,24.25 arc-45 78.8,23.89 78.8,20.01 arc45 78.95,19.65 79.1,19.5 arc45 79.34,19.4 v80.6,19.4
SPI_MOSI  (via drill 0.3)
  Top 0.3: J3.14 79.29,19.5 arc45 79.65,19.65 80.15,20.15 arc-45 80.51,20.3 v80.6,20.3
  Bottom 0.3: v80.6,20.3 79.65,21.25 arc-45 79.5,21.61 79.5,24.09 arc45 79.35,24.45 76.35,27.45 arc45 75.99,27.6 55.9,27.6 arc-45 55.54,27.75 MOD1.PA7
SUPPLY  (via drill 0.3)
  Top 0.3: U3.6 59.9,6.05 | 59.9,6.05 58.91,6.05 arc45 58.55,5.9 C11.1 | C7.1 59.9,6.05 | v63,10 63,8.92 arc-45 R14.1 | U2.6 19.03,15.9 | 19.03,15.9 19.03,14.4 C1.1 19.45,13.66 arc45 19.6,13.3 20.25,12.65 arc45 20.61,12.5 TP5.TP | C5.1 19.03,15.9 | U2.4 16.57,17.54 | 16.57,17.54 Q3.2 v16.55,16.5 Q4.2 17.29,15.45 arc45 17.65,15.6 R18.1 17.8,15.9 19.03,15.9 | 16.57,17.54 arc-45 Q3.2
  Top 0.5: 17.8,15.45 R18.1 | C11.1 arc-45 58.28,5.7 v57.3,5.7
  Bottom 0.5: v16.55,16.5 15.75,15.7 arc45 15.6,15.34 15.6,10.61 arc45 15.75,10.25 16.8,9.2 arc45 17.16,9.05 21.55,9.05 25.05,5.55 arc45 25.41,5.4 56.79,5.4 arc45 57.15,5.55 v57.3,5.7 61.45,9.85 arc-45 61.81,10 v63,10
SWCLK
  Top 0.2: CN1.4 19.83,4.85 arc-45 20.18,5 27.28,5 arc-45 27.64,4.85 MOD1.SWCLK
SWDIO
  Top 0.2: CN1.2 19.15,5.45 arc45 19.3,5.8 19.3,7.29 arc-45 19.45,7.65 19.85,8.05 arc-45 20.21,8.2 21.69,8.2 arc-45 22.05,8.05 23.45,6.65 arc45 23.81,6.5 MOD1.SWDIO
USART_RX
  Top 0.3: MOD1.PB7 33.27,24.28 arc45 33.63,24.43 34.72,25.52 arc45 34.87,25.88 CN2.3
USART_TX
  Top 0.3: CN2.2 32.33,31.14 arc-45 32.18,30.78 30.91,29.51 arc-45 30.55,29.36 MOD1.PB6
USER_BUTTON  (via drill 0.3)
  Top 0.3: SW2.2_1 arc45 85.8,36.4 85.3,35.9 arc-45 85.06,35.8 v84.3,35.8 83.61,35.8 arc-45 83.25,35.95 82.8,36.4 arc45 SW2.2_2 80.7,36.52 | 80.7,36.52 79.28,36.52 arc45 R20.2 | C18.1 80.66,36.51 arc-45 80.7,36.52
  Bottom 0.3: MOD1.PA4 53.33,24.28 arc-45 52.97,24.43 52.45,24.95 arc-45 52.3,25.31 52.3,31.89 arc-45 52.45,32.25 53.05,32.85 arc-45 53.41,33 80.19,33 arc45 80.55,33.15 83.05,35.65 arc-45 83.41,35.8 v84.3,35.8
VCOM
  Top 0.3: 77.6,24.5 J3.24 77.31,24.5 arc-45 76.95,24.65 75.35,26.25 arc45 74.99,26.4 C19.1
VDD
  Top 0.3: J3.18 77.31,21.5 arc45 76.95,21.35 76.25,20.65 arc45 76.1,20.29 76.1,19.51 arc-45 75.95,19.15 75.55,18.75 arc-45 75.19,18.6 C25.1
VGH  (via drill 0.3)
  Top 0.3: J3.21 76.91,23 arc45 76.55,22.85 76.05,22.35 arc-45 75.69,22.2 v75.5,22.2 C21.1 | v70.7,17.9 69.76,17.9 arc45 D6.K
  Bottom 0.3: v75.5,22.2 72.81,22.2 arc45 72.45,22.05 70.85,20.45 arc45 70.7,20.09 v70.7,17.9
VGL  (via drill 0.3)
  Top 0.3: J3.23 76.71,24 arc-45 76.35,24.15 v75.85,24.65 75.65,24.85 arc45 75.29,25 C28.1 | D3.A 69.67,19.2 v68.7,19.2
  Bottom 0.3: v68.7,19.2 74,24.5 arc-45 74.36,24.65 v75.85,24.65
VSH1
  Top 0.3: J3.20 77.31,22.5 arc45 76.95,22.35 75.55,20.95 arc-45 75.19,20.8 C26.1
VSH2
  Top 0.3: J3.5 C23.1
VSL
  Top 0.3: J3.22 74.59,23.5 arc-45 C27.1
(copper drawn outside any net)
  shapes: Bottom area x1, Top area x1

### Text on the board
tPlace: 3V3 | TX | RX | GND | BOOT | RESET | USER | + | - | BAT | CHG | 2V MCU | 5V | DISPLAY / SSD1680 | GND | 2V uC | SUP | 2V SNS | GND | TEFNUT v1